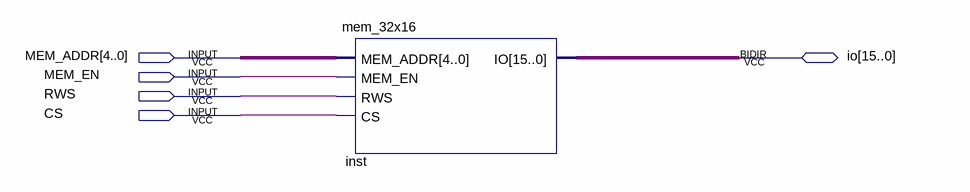
[diagram p0: schematic sheet]
// Quartus schematic testbidir.bdf as structural Verilog: 1 symbols, 5 pins
module testbidir (
  input  [4:0] MEM_ADDR,
  input  MEM_EN,
  input  RWS,
  input  CS,
  inout  [15:0] io
);

  mem_32x16 inst (.MEM_ADDR(MEM_ADDR), .MEM_EN(MEM_EN), .RWS(RWS), .CS(CS), .IO(io));
endmodule
